# Altium project AATB.PrjPcb (part 2 of 2)

## Sheet ATB-Basics-PartB.SchDoc
size A4
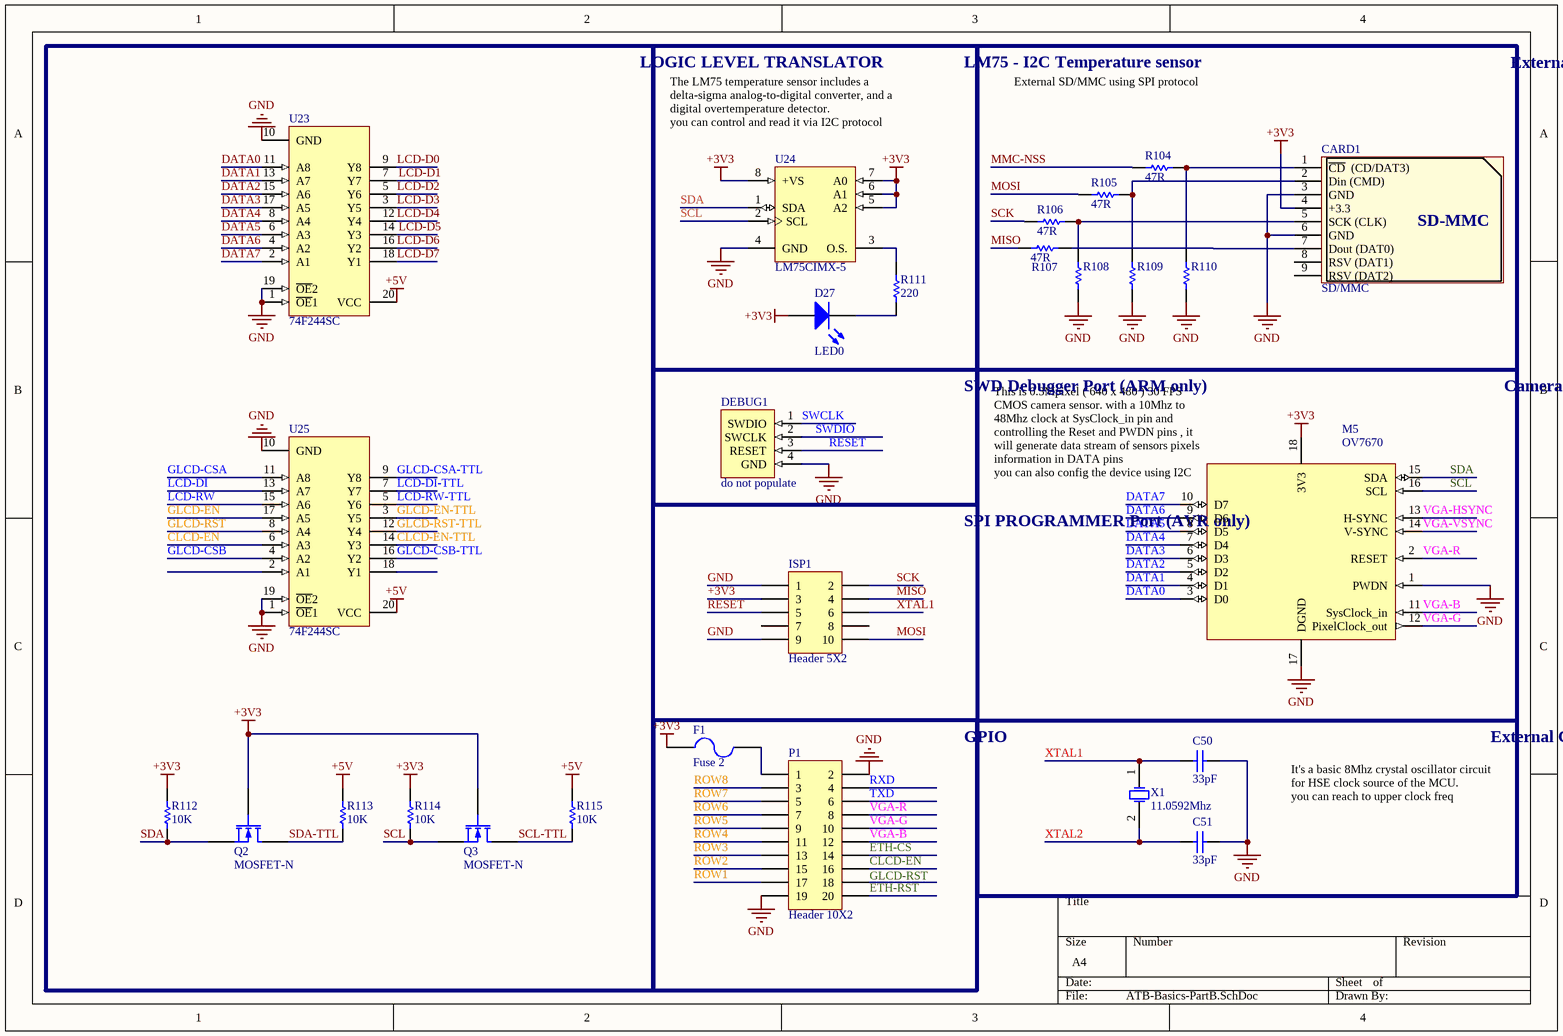
[diagram p4: ATB-Basics-PartB.SchDoc]

### Parts
C50  33pF  [SMD_R0805]
C51  33pF  [SMD_R0805]
CARD1  SD/MMC  [SD/MMC  Connector]
D27  LED0  [3.5X2.8X1.9]
DEBUG1  do not populate  [SWD-PORT]
F1  Fuse 2  [SelfFuse-1206]  (no BOM)
ISP1  Header 5X2  [HDR2X5]
M5  OV7670  [OV7670]
P1  Header 10X2  [HDR2X10]
Q2  MOSFET-N  [TR_P3]
Q3  MOSFET-N  [TR_P3]
R104  47R  [SMD_R0805]
R105  47R  [SMD_R0805]
R106  47R  [SMD_R0805]
R107  47R  [SMD_R0805]
R108  DNI  [SMD_R0805]  (value not drawn)
R109  DNI  [SMD_R0805]  (value not drawn)
R110  DNI  [SMD_R0805]  (value not drawn)
R111  220  [SMD_R0805]
R112  10K  [SMD_R0805]
R113  10K  [SMD_R0805]
R114  10K  [SMD_R0805]
R115  10K  [SMD_R0805]
U23  74F244SC  [751D-04_N]
U24  LM75CIMX-5  [M08A_M]
U25  74F244SC  [751D-04_N]
X1  11.0592Mhz  [XTALL]

### Blocks framed on the sheet
LOGIC LEVEL TRANSLATOR: Q2 Q3 R112-R115 U23 U25
LM75 - I2C Temperature sensor: D27 R111 U24
External Memory: CARD1 R104-R110
SWD Debugger Port (ARM only): DEBUG1
Camera Module - OV7670: M5
GPIO: F1 P1
External Clock - HSE: C50 C51 X1

### Nets
+3V3: CARD1.4(+3.3) D27.1(A) F1.1 ISP1.3 M5.18(3V3) Q2.2(G) Q3.2(G) R112.2 R114.2 U24.5(A2) U24.6(A1) U24.7(A0) U24.8(+VS)
+5V: R113.2 R115.2 U23.20(VCC) U25.20(VCC)
GND: C50.1 C51.2 CARD1.3(GND) CARD1.6(GND) DEBUG1.4(GND) ISP1.1 ISP1.9 M5.1(PWDN) M5.17(DGND) P1.2 P1.19 R108.1 R109.1 R110.1 U23.1(~{OE}1) U23.10(GND) U23.19(~{OE}2) U24.4(GND) U25.1(~{OE}1) U25.10(GND) U25.19(~{OE}2)
CLCD-EN: P1.16 U25.6(A3)
CLCD-EN-TTL: U25.14(Y3)
DATA0: M5.3(D0) U23.11(A8)
DATA1: M5.4(D1) U23.13(A7)
DATA2: M5.5(D2) U23.15(A6)
DATA3: M5.6(D3) U23.17(A5)
DATA4: M5.7(D4) U23.8(A4)
DATA5: M5.8(D5) U23.6(A3)
DATA6: M5.9(D6) U23.4(A2)
DATA7: M5.10(D7) U23.2(A1)
ETH-CS: P1.14
ETH-RST: P1.20
GLCD-CSA: U25.11(A8)
GLCD-CSA-TTL: U25.9(Y8)
GLCD-CSB: U25.4(A2)
GLCD-CSB-TTL: U25.16(Y2)
GLCD-EN: U25.17(A5)
GLCD-EN-TTL: U25.3(Y5)
GLCD-RST: U25.8(A4)
GLCD-RST-TTL: U25.12(Y4)
LCD-D0: U23.9(Y8)
LCD-D1: U23.7(Y7)
LCD-D2: U23.5(Y6)
LCD-D3: U23.3(Y5)
LCD-D4: U23.12(Y4)
LCD-D5: U23.14(Y3)
LCD-D6: U23.16(Y2)
LCD-D7: U23.18(Y1)
LCD-DI: U25.13(A7)
LCD-DI-TTL: U25.7(Y7)
LCD-RW: U25.15(A6)
LCD-RW-TTL: U25.5(Y6)
MISO: ISP1.4 R107.1
MMC-NSS: R104.1
MOSI: ISP1.10 R105.1
RESET: DEBUG1.3(RESET) ISP1.5
ROW1: P1.17
ROW2: P1.15
ROW3: P1.13
ROW4: P1.11
ROW5: P1.9
ROW6: P1.7
ROW7: P1.5
ROW8: P1.3
RXD: P1.4
SCK: ISP1.2 R106.1
SCL: M5.16(SCL) Q3.3(S) R114.1 U24.2(SCL)
SCL-TTL: Q3.1(D) R115.1
SDA: M5.15(SDA) Q2.3(S) R112.1 U24.1(SDA)
SDA-TTL: Q2.1(D) R113.1
SWCLK: DEBUG1.1(SWDIO)
SWDIO: DEBUG1.2(SWCLK)
TXD: P1.6
VGA-B: M5.11(SysClock_in) P1.12
VGA-G: M5.12(PixelClock_out) P1.10
VGA-HSYNC: M5.13(H-SYNC)
VGA-R: M5.2(RESET) P1.8
VGA-VSYNC: M5.14(V-SYNC)
XTAL1: C50.2 ISP1.6 X1.1(OSC1)
XTAL2: C51.1 X1.2(OSC2)
NetCARD1_1: CARD1.1(~{CD}__(CD/DAT3)) CARD1.2(Din_(CMD)) CARD1.5(SCK_(CLK)) CARD1.7(Dout_(DAT0)) R104.2 R105.2 R106.2 R107.2 R108.2 R109.2 R110.2
NetD27_2: D27.2(K) R111.1
NetF1_2: F1.2 P1.1
NetR111_2: R111.2 U24.3(O.S.)

Not connected (* = marked no-connect by the designer): CARD1 8(RSV_(DAT1)) 9(RSV_(DAT2)); ISP1 7 8; P1 18; U25 2(A1) 18(Y1)

### Notes on the sheet
- External SD/MMC using SPI protocol
- (near U24) The LM75 temperature sensor includes a delta-sigma analog-to-digital converter, and a digital overtemperature detector.
  you can control and read it via I2C protocol
- (near M5) This is 0.3Mpixel ( 640 x 480 ) 30 FPS CMOS camera sensor. with a 10Mhz to 48Mhz clock at SysClock_in pin and controlling the Reset and PWDN pins , it will generate data stream of sensors pixels information in DATA pins
  you can also config the device using I2C
- SPI PROGRAMMER Port (AVR only)
- It's a basic 8Mhz crystal oscillator circuit for HSE clock source of the MCU.
  you can reach to upper clock freq
- Labels drawn without touching a wire or pin: GLCD-RST
- (in symbol MMC) SD-MMC

### Library data of the parts
C50 C51 = Cap: Capacitor; Published: 8-Jun-2000; LatestRevisionDate: 17-Jul-2002; LatestRevisionNote: Re-released for DXP Platform.; PackageReference: RAD-0.3; Publisher: Altium Limited; Value: 33pF
CARD1 = MMC
D27 = LED0: Typical INFRARED GaAs LED; Published: 8-Jun-2000; LatestRevisionDate: 08-Jul-2005; LatestRevisionNote: Mech Layer 1 removed.; PackageReference: LED-0; Publisher: Altium Limited
DEBUG1 = SWD-PORT: SWD debug and programming port
F1 = Fuse 2: Fuse; Published: 8-Jun-2000; LatestRevisionDate: 17-Jul-2002; LatestRevisionNote: Re-released for DXP Platform.; PackageReference: PIN-W2/E2.8; Publisher: Altium Limited; PackageDescription: Thru-Hole; 2 Leads
ISP1 = Header 5X2: Header, 5-Pin, Dual row; LatestRevisionDate: 17-Jul-2002; LatestRevisionNote: Re-released for DXP Platform.; Publisher: Altium Limited
M5 = CAM-OV7670: OV7670 CAMERA Module
P1 = Header 10X2: Header, 10-Pin, Dual row; LatestRevisionDate: 17-Jul-2002; LatestRevisionNote: Re-released for DXP Platform.; Publisher: Altium Limited
Q2 Q3 = MOSFET-N: N-Channel MOSFET; Published: 8-Jun-2000; LatestRevisionDate: 17-Jul-2002; LatestRevisionNote: Re-released for DXP Platform.; PackageVersion: 1995/1996; PackageReference: E3; Publisher: Altium Limited; PackageDescription: TO, Flat Index; 3 In-Line, Axial Leads; Body Dia. 4.6mm; Lead Dia. 0.5 mm (max)
R104-R115 = Res1: Resistor; Published: 8-Jun-2000; LatestRevisionDate: 17-Jul-2002; LatestRevisionNote: Re-released for DXP Platform.; PackageReference: AXIAL-0.3; Publisher: Altium Limited
  R104-R107: Value: 47R
  R108-R110: Value: DNI
  R111: Value: 220
  R112-R115: Value: 10K
U23 U25 = 74F244SC: Octal Buffer/Line Driver with Tri-State Output; Published: 15-Apr-2002; LatestRevisionDate: 13-Apr-2006; LatestRevisionNote: IPC-7351 Footprint Added.; DatasheetVersion: May-1995; PackageVersion: 2000; PackageReference: M20B; Publisher: Altium Limited; PackageDescription: 20-Pin Small Outline Integrated Circuit 1.27 mm Pitch; Code_JEDEC: MS-013-AC; Code_IPC: SOIC127P1030-20; ComponentLink1Description: Manufacturer Link; ComponentLink1URL: http://www.national.com/; ComponentLink2Description: Datasheet; ComponentLink2URL: http://www.fairchildsemi.com/ds/74/74F244.pdf; ComponentLink3Description: URL Link1; ComponentLink3URL: http://www.fairchildsemi.com/pf/74/74F244.html
U24 = CMP-0066-00058-2: Digital Temperature Sensor and Thermal Watchdog with Two-Wire Interface, 8 pin SOIC NARROW; Manufacturer: National Semiconductor; CompType: Temp Sensor IC; PackageTopMarking: NSZXTT*LM75*CIM5; PowerWise: N; Code_IPC: SOIC127P600-8; PackageVersion: revM, May-2009; ComponentLink3URL: http://www.national.com/packaging/folders/m08a.html; ComponentLink1URL: http://www.national.com/ds/LM/LM75C.pdf; ComponentLink2Description: LM75C Web Page; RoHS: N; PackageReference: M08A; Code_JEDEC: MS-012-AA; ComponentLink2URL: http://www.national.com/pf/LM/LM75C.html; PackageDescription: SOIC Narrow, 4.9 x 3.9 x 1.45mm, 8 Lead, 1.27mm Pitch; DatasheetVersion: Jul-2009; ComponentLink1Description: LM75C Datasheet; PinCount: 8; ComponentLink3Description: M08A Package Page; RevisionNote: Component URLs added
X1 = XTAL: Crystal Oscillator; Published: 8-Jun-2000; LatestRevisionDate: 17-Jul-2002; LatestRevisionNote: Re-released for DXP Platform.; PackageReference: R38; Publisher: Altium Limited

## Sheet AATB-V2.1.SchDoc
size A4; PageSetup: Record=PageOptions|CenterHorizontal=True|CenterVertical=True|PrintScale=1.00|XCorrection=1.00|YCorrection=1.00|PrintKind=0|BorderSize=5000000|LeftOffset=0|BottomOffset=0|Orientation=2|PaperLength=1000|PaperWidth=1000|Scale=100|PaperSource=15|PrintQuality=600|MediaType=1|DitherType=10|PaperKind=A3|PrintScaleMode=0
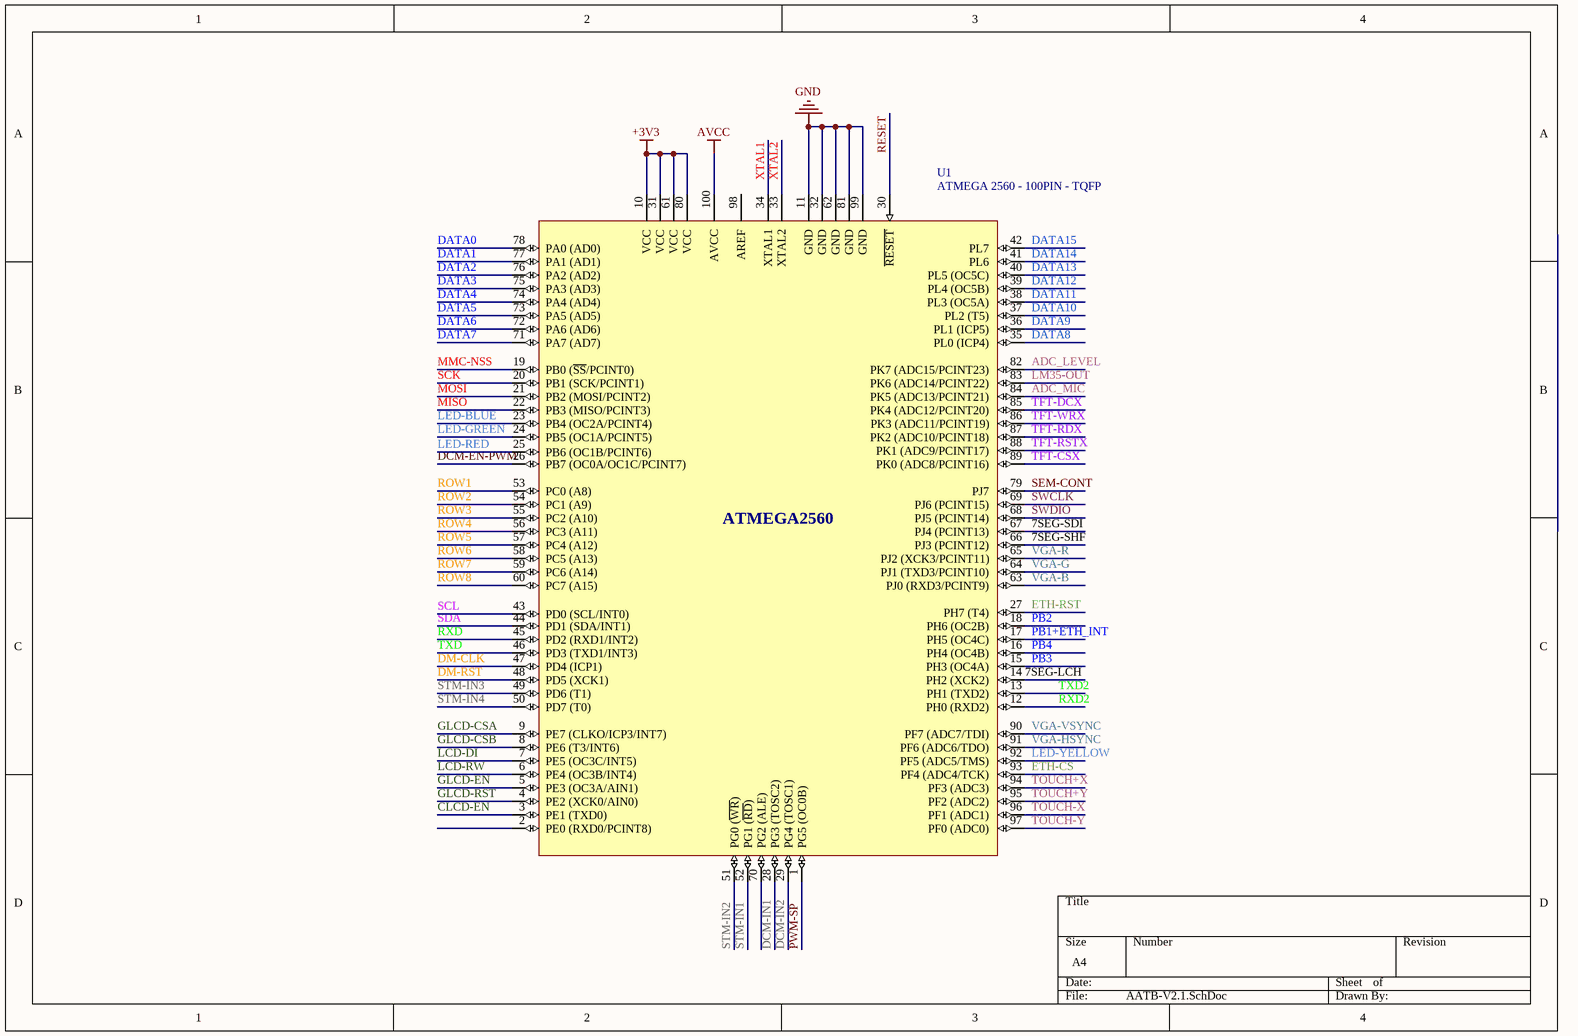
[diagram p5: AATB-V2.1.SchDoc]

### Parts
U1  ATMEGA 2560 - 100PIN - TQFP  [cpu-100-26]

### Nets
+3V3: U1.10(VCC) U1.31(VCC) U1.61(VCC) U1.80(VCC)
AVCC: U1.100(AVCC)
GND: U1.11(GND) U1.32(GND) U1.62(GND) U1.81(GND) U1.99(GND)
7SEG-LCH: U1.14(PH2_(XCK2))
7SEG-SDI: U1.67(PJ4_(PCINT13))
7SEG-SHF: U1.66(PJ3_(PCINT12))
ADC_LEVEL: U1.82(PK7_(ADC15/PCINT23))
ADC_MIC: U1.84(PK5_(ADC13/PCINT21))
CLCD-EN: U1.3(PE1_(TXD0))
DATA0: U1.78(PA0_(AD0))
DATA1: U1.77(PA1_(AD1))
DATA2: U1.76(PA2_(AD2))
DATA3: U1.75(PA3_(AD3))
DATA4: U1.74(PA4_(AD4))
DATA5: U1.73(PA5_(AD5))
DATA6: U1.72(PA6_(AD6))
DATA7: U1.71(PA7_(AD7))
DATA8: U1.35(PL0_(ICP4))
DATA9: U1.36(PL1_(ICP5))
DATA10: U1.37(PL2_(T5))
DATA11: U1.38(PL3_(OC5A))
DATA12: U1.39(PL4_(OC5B))
DATA13: U1.40(PL5_(OC5C))
DATA14: U1.41(PL6)
DATA15: U1.42(PL7)
DCM-EN-PWM: U1.26(PB7_(OC0A/OC1C/PCINT7))
DCM-IN1: U1.28(PG3_(TOSC2))
DCM-IN2: U1.29(PG4_(TOSC1))
DM-CLK: U1.47(PD4_(ICP1))
DM-RST: U1.48(PD5_(XCK1))
ETH-CS: U1.93(PF4_(ADC4/TCK))
ETH-RST: U1.27(PH7_(T4))
GLCD-CSA: U1.9(PE7_(CLKO/ICP3/INT7))
GLCD-CSB: U1.8(PE6_(T3/INT6))
GLCD-EN: U1.5(PE3_(OC3A/AIN1))
GLCD-RST: U1.4(PE2_(XCK0/AIN0))
LCD-DI: U1.7(PE5_(OC3C/INT5))
LCD-RW: U1.6(PE4_(OC3B/INT4))
LED-BLUE: U1.23(PB4_(OC2A/PCINT4))
LED-GREEN: U1.24(PB5_(OC1A/PCINT5))
LED-RED: U1.25(PB6_(OC1B/PCINT6))
LED-YELLOW: U1.92(PF5_(ADC5/TMS))
LM35-OUT: U1.83(PK6_(ADC14/PCINT22))
MISO: U1.22(PB3_(MISO/PCINT3))
MMC-NSS: U1.19(PB0_(~{SS}/PCINT0))
MOSI: U1.21(PB2_(MOSI/PCINT2))
PB1+ETH_INT: U1.17(PH5_(OC4C))
PB2: U1.18(PH6_(OC2B))
PB3: U1.15(PH3_(OC4A))
PB4: U1.16(PH4_(OC4B))
PWM-SP: U1.1(PG5_(OC0B))
RESET: U1.30(~{RESET})
ROW1: U1.53(PC0_(A8))
ROW2: U1.54(PC1_(A9))
ROW3: U1.55(PC2_(A10))
ROW4: U1.56(PC3_(A11))
ROW5: U1.57(PC4_(A12))
ROW6: U1.58(PC5_(A13))
ROW7: U1.59(PC6_(A14))
ROW8: U1.60(PC7_(A15))
RXD: U1.45(PD2_(RXD1/INT2))
RXD2: U1.12(PH0_(RXD2))
SCK: U1.20(PB1_(SCK/PCINT1))
SCL: U1.43(PD0_(SCL/INT0))
SDA: U1.44(PD1_(SDA/INT1))
SEM-CONT: U1.79(PJ7)
STM-IN1: U1.52(PG1_(~{RD}))
STM-IN2: U1.51(PG0_(~{WR}))
STM-IN3: U1.49(PD6_(T1))
STM-IN4: U1.50(PD7_(T0))
SWCLK: U1.69(PJ6_(PCINT15))
SWDIO: U1.68(PJ5_(PCINT14))
TFT-CSX: U1.89(PK0_(ADC8/PCINT16))
TFT-DCX: U1.85(PK4_(ADC12/PCINT20))
TFT-RDX: U1.87(PK2_(ADC10/PCINT18))
TFT-RSTX: U1.88(PK1_(ADC9/PCINT17))
TFT-WRX: U1.86(PK3_(ADC11/PCINT19))
Touch+X: U1.94(PF3_(ADC3))
Touch+Y: U1.95(PF2_(ADC2))
Touch-X: U1.96(PF1_(ADC1))
Touch-Y: U1.97(PF0_(ADC0))
TXD: U1.46(PD3_(TXD1/INT3))
TXD2: U1.13(PH1_(TXD2))
VGA-B: U1.63(PJ0_(RXD3/PCINT9))
VGA-G: U1.64(PJ1_(TXD3/PCINT10))
VGA-HSYNC: U1.91(PF6_(ADC6/TDO))
VGA-R: U1.65(PJ2_(XCK3/PCINT11))
VGA-VSYNC: U1.90(PF7_(ADC7/TDI))
XTAL1: U1.34(XTAL1)
XTAL2: U1.33(XTAL2)

Not connected (* = marked no-connect by the designer): U1 2(PE0_(RXD0/PCINT8)) 70(PG2_(ALE)) 98(AREF)

### Notes on the sheet
- (in symbol ATMEGA 2560) ATMEGA2560

### Library data of the parts
U1 = ATMEGA 2560

## Nets that join several sheets
+3V3: ATB-Display (TFT1.2 TFT1.3), ATB-Power (27 pins), ATB-Ports (21 pins), ATB-Basics-PartA (12 pins), ATB-Basics-PartB (13 pins), AATB-V2.1 (U1.10 U1.31 U1.61 U1.80)
+5V: ATB-Display (15 pins), ATB-Power (7 pins), ATB-Ports (D9.1 R62.1 R63.1), ATB-Basics-PartA (11 pins), ATB-Basics-PartB (R113.2 R115.2 U23.20 U25.20)
AVCC: ATB-Power (C10.1 C11#1.1 L4.1), AATB-V2.1 (U1.100)
GND: ATB-Display (31 pins), ATB-Power (43 pins), ATB-Ports (48 pins), ATB-Basics-PartA (30 pins), ATB-Basics-PartB (21 pins), AATB-V2.1 (5 pins)
7SEG-LCH: ATB-Display (U5.12 U6.12), AATB-V2.1 (U1.14)
7SEG-SDI: ATB-Display (U5.14), AATB-V2.1 (U1.67)
7SEG-SHF: ATB-Display (U5.11 U6.11), AATB-V2.1 (U1.66)
ADC_LEVEL: ATB-Basics-PartA (C39.2 R87#2.1 U19.2), AATB-V2.1 (U1.82)
ADC_MIC: ATB-Basics-PartA (M4.2), AATB-V2.1 (U1.84)
CLCD-EN: ATB-Basics-PartB (P1.16 U25.6), AATB-V2.1 (U1.3)
CLCD-EN-TTL: ATB-Display (CH-LCD1.6), ATB-Basics-PartB (U25.14)
DATA0: ATB-Display (R14.2), ATB-Basics-PartB (M5.3 U23.11), AATB-V2.1 (U1.78)
DATA1: ATB-Display (R16.2), ATB-Basics-PartB (M5.4 U23.13), AATB-V2.1 (U1.77)
DATA2: ATB-Display (R18.2), ATB-Basics-PartB (M5.5 U23.15), AATB-V2.1 (U1.76)
DATA3: ATB-Display (R21.2), ATB-Basics-PartB (M5.6 U23.17), AATB-V2.1 (U1.75)
DATA4: ATB-Display (R23.2), ATB-Basics-PartB (M5.7 U23.8), AATB-V2.1 (U1.74)
DATA5: ATB-Display (R25.1), ATB-Basics-PartB (M5.8 U23.6), AATB-V2.1 (U1.73)
DATA6: ATB-Display (R27.1), ATB-Basics-PartB (M5.9 U23.4), AATB-V2.1 (U1.72)
DATA7: ATB-Display (R29.1), ATB-Basics-PartB (M5.10 U23.2), AATB-V2.1 (U1.71)
DATA8: ATB-Display (R30.1), ATB-Basics-PartA (R74#2.1), AATB-V2.1 (U1.35)
DATA9: ATB-Display (R28.1), ATB-Basics-PartA (R76#2.1), AATB-V2.1 (U1.36)
DATA10: ATB-Display (R26.1), ATB-Basics-PartA (R79.1), AATB-V2.1 (U1.37)
DATA11: ATB-Display (R24.2), ATB-Basics-PartA (R81.1), AATB-V2.1 (U1.38)
DATA12: ATB-Display (R22.2), ATB-Basics-PartA (R83.1), AATB-V2.1 (U1.39)
DATA13: ATB-Display (R19.2), ATB-Basics-PartA (R84.1), AATB-V2.1 (U1.40)
DATA14: ATB-Display (R17.2), ATB-Basics-PartA (R85.1), AATB-V2.1 (U1.41)
DATA15: ATB-Display (R15.2), ATB-Basics-PartA (R86.1), AATB-V2.1 (U1.42)
DM-CLK: ATB-Display (U4.14), AATB-V2.1 (U1.47)
DM-RST: ATB-Display (U4.9 U4.15), AATB-V2.1 (U1.48)
ETH-CS: ATB-Ports (R55.1 U11.9), ATB-Basics-PartB (P1.14), AATB-V2.1 (U1.93)
ETH-RST: ATB-Ports (R56.1 U11.10), ATB-Basics-PartB (P1.20), AATB-V2.1 (U1.27)
GLCD-CSA: ATB-Basics-PartB (U25.11), AATB-V2.1 (U1.9)
GLCD-CSA-TTL: ATB-Display (G-LCD1.15), ATB-Basics-PartB (U25.9)
GLCD-CSB: ATB-Basics-PartB (U25.4), AATB-V2.1 (U1.8)
GLCD-CSB-TTL: ATB-Display (G-LCD1.16), ATB-Basics-PartB (U25.16)
GLCD-EN: ATB-Basics-PartB (U25.17), AATB-V2.1 (U1.5)
GLCD-EN-TTL: ATB-Display (G-LCD1.6), ATB-Basics-PartB (U25.3)
GLCD-RST: ATB-Basics-PartB (U25.8), AATB-V2.1 (U1.4)
GLCD-RST-TTL: ATB-Display (G-LCD1.17), ATB-Basics-PartB (U25.12)
LCD-D0: ATB-Display (G-LCD1.7), ATB-Basics-PartB (U23.9)
LCD-D1: ATB-Display (G-LCD1.8), ATB-Basics-PartB (U23.7)
LCD-D2: ATB-Display (G-LCD1.9), ATB-Basics-PartB (U23.5)
LCD-D3: ATB-Display (G-LCD1.10), ATB-Basics-PartB (U23.3)
LCD-D4: ATB-Display (CH-LCD1.11 G-LCD1.11), ATB-Basics-PartB (U23.12)
LCD-D5: ATB-Display (CH-LCD1.12 G-LCD1.12), ATB-Basics-PartB (U23.14)
LCD-D6: ATB-Display (CH-LCD1.13 G-LCD1.13), ATB-Basics-PartB (U23.16)
LCD-D7: ATB-Display (CH-LCD1.14 G-LCD1.14), ATB-Basics-PartB (U23.18)
LCD-DI: ATB-Basics-PartB (U25.13), AATB-V2.1 (U1.7)
LCD-DI-TTL: ATB-Display (CH-LCD1.4 G-LCD1.4), ATB-Basics-PartB (U25.7)
LCD-RW: ATB-Basics-PartB (U25.15), AATB-V2.1 (U1.6)
LCD-RW-TTL: ATB-Display (G-LCD1.5), ATB-Basics-PartB (U25.5)
LED-BLUE: ATB-Basics-PartA (R94.1 S17.1), AATB-V2.1 (U1.23)
LED-GREEN: ATB-Basics-PartA (R91.1 S17.2), AATB-V2.1 (U1.24)
LED-RED: ATB-Basics-PartA (R90.1), AATB-V2.1 (U1.25)
LED-YELLOW: ATB-Basics-PartA (R99.1), AATB-V2.1 (U1.92)
LM35-OUT: ATB-Basics-PartA (R92.2 U20.2), AATB-V2.1 (U1.83)
MISO: ATB-Ports (R87#1.1 U11.6 U12.11), ATB-Basics-PartB (ISP1.4 R107.1), AATB-V2.1 (U1.22)
MMC-NSS: ATB-Basics-PartB (R104.1), AATB-V2.1 (U1.19)
MOSI: ATB-Ports (U11.7 U12.18), ATB-Basics-PartB (ISP1.10 R105.1), AATB-V2.1 (U1.21)
PB1+ETH_INT: ATB-Basics-PartA (R75#2.2 SW1.1), AATB-V2.1 (U1.17)
PB2: ATB-Basics-PartA (R78.2 SW2.1), AATB-V2.1 (U1.18)
PB3: ATB-Basics-PartA (R80.2 SW3.1), AATB-V2.1 (U1.15)
PB4: ATB-Basics-PartA (R82.2 SW4.1), AATB-V2.1 (U1.16)
PWM-SP: ATB-Basics-PartA (R95.1), AATB-V2.1 (U1.1)
RESET: ATB-Ports (U12.3 U12.5 U12.7), ATB-Basics-PartA (R77#2.1 RESET1.1), ATB-Basics-PartB (DEBUG1.3 ISP1.5), AATB-V2.1 (U1.30)
ROW1: ATB-Display (U2.2), ATB-Basics-PartB (P1.17), AATB-V2.1 (U1.53)
ROW2: ATB-Display (U2.4), ATB-Basics-PartB (P1.15), AATB-V2.1 (U1.54)
ROW3: ATB-Display (U2.6), ATB-Basics-PartB (P1.13), AATB-V2.1 (U1.55)
ROW4: ATB-Display (U2.8), ATB-Basics-PartB (P1.11), AATB-V2.1 (U1.56)
ROW5: ATB-Display (U2.17), ATB-Basics-PartB (P1.9), AATB-V2.1 (U1.57)
ROW6: ATB-Display (U2.15), ATB-Basics-PartB (P1.7), AATB-V2.1 (U1.58)
ROW7: ATB-Display (U2.13), ATB-Basics-PartB (P1.5), AATB-V2.1 (U1.59)
ROW8: ATB-Display (U2.11), ATB-Basics-PartB (P1.3), AATB-V2.1 (U1.60)
RXD: ATB-Ports (U10#2.7), ATB-Basics-PartB (P1.4), AATB-V2.1 (U1.45)
RXD2: ATB-Ports (R46#2.2), AATB-V2.1 (U1.12)
SCK: ATB-Ports (U11.8 U12.12 U12.14), ATB-Basics-PartB (ISP1.2 R106.1), AATB-V2.1 (U1.20)
SCL: ATB-Basics-PartA (U17.6), ATB-Basics-PartB (M5.16 Q3.3 R114.1 U24.2), AATB-V2.1 (U1.43)
SCL-TTL: ATB-Basics-PartA (U18.6), ATB-Basics-PartB (Q3.1 R115.1)
SDA: ATB-Basics-PartA (U17.5), ATB-Basics-PartB (M5.15 Q2.3 R112.1 U24.1), AATB-V2.1 (U1.44)
SDA-TTL: ATB-Basics-PartA (U18.5), ATB-Basics-PartB (Q2.1 R113.1)
SWCLK: ATB-Basics-PartB (DEBUG1.1), AATB-V2.1 (U1.69)
SWDIO: ATB-Basics-PartB (DEBUG1.2), AATB-V2.1 (U1.68)
TFT-CSX: ATB-Display (R8.2), AATB-V2.1 (U1.89)
TFT-DCX: ATB-Display (R10.2), AATB-V2.1 (U1.85)
TFT-RDX: ATB-Display (R12.2), AATB-V2.1 (U1.87)
TFT-RSTX: ATB-Display (R13.2), AATB-V2.1 (U1.88)
TFT-WRX: ATB-Display (R11.2), AATB-V2.1 (U1.86)
Touch+X: ATB-Display (TFT1.27), AATB-V2.1 (U1.94)
Touch+Y: ATB-Display (TFT1.26), AATB-V2.1 (U1.95)
Touch-X: ATB-Display (TFT1.29), AATB-V2.1 (U1.96)
Touch-Y: ATB-Display (TFT1.28), AATB-V2.1 (U1.97)
TXD: ATB-Ports (U10#2.8), ATB-Basics-PartB (P1.6), AATB-V2.1 (U1.46)
TXD2: ATB-Ports (R48.1), AATB-V2.1 (U1.13)
VGA-B: ATB-Ports (R75#1.2), ATB-Basics-PartB (M5.11 P1.12), AATB-V2.1 (U1.63)
VGA-G: ATB-Ports (R76#1.2), ATB-Basics-PartB (M5.12 P1.10), AATB-V2.1 (U1.64)
VGA-HSYNC: ATB-Ports (R73.2), ATB-Basics-PartB (M5.13), AATB-V2.1 (U1.91)
VGA-R: ATB-Ports (R77#1.2), ATB-Basics-PartB (M5.2 P1.8), AATB-V2.1 (U1.65)
VGA-VSYNC: ATB-Ports (R74#1.2), ATB-Basics-PartB (M5.14), AATB-V2.1 (U1.90)
XTAL1: ATB-Basics-PartB (C50.2 ISP1.6 X1.1), AATB-V2.1 (U1.34)
XTAL2: ATB-Basics-PartB (C51.1 X1.2), AATB-V2.1 (U1.33)